# Altium schematic sheet BoardB-FPGA2.SchDoc
size A; SheetNumber: 4; SheetTotal: 9
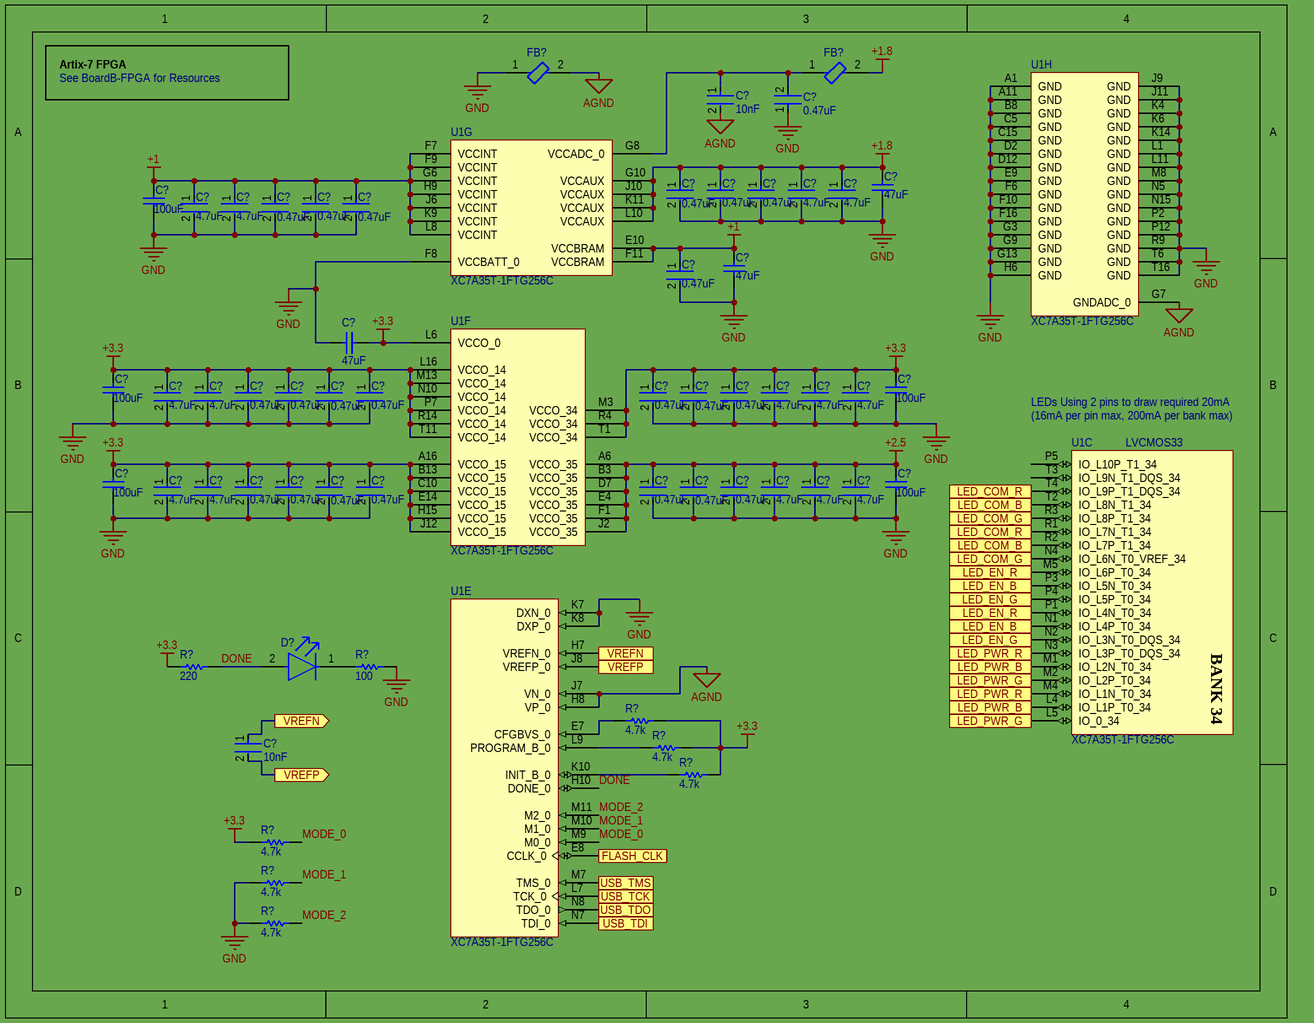
[diagram p0: BoardB-FPGA2.SchDoc]

## Parts
(Parts that share a designator on the sheet are numbered #1, #2 ... from top to bottom, then left to right.)
C?#1  10nF  [FP-GRM033-0_03-IPC_A]
C?#2  0.47uF  [FP-GRM033-0_03-IPC_C]
C?#3  0.47uF  [FP-GRM033-0_03-IPC_C]
C?#4  0.47uF  [FP-GRM033-0_03-IPC_C]
C?#5  0.47uF  [FP-GRM033-0_03-IPC_C]
C?#6  4.7uF  [FP-GRM155-0_1-IPC_B]
C?#7  4.7uF  [FP-GRM155-0_1-IPC_B]
C?#8  4.7uF  [FP-GRM155-0_1-IPC_B]
C?#9  4.7uF  [FP-GRM155-0_1-IPC_B]
C?#10  0.47uF  [FP-GRM033-0_03-IPC_C]
C?#11  0.47uF  [FP-GRM033-0_03-IPC_C]
C?#12  0.47uF  [FP-GRM033-0_03-IPC_C]
C?#13  47uF  [MURA-1210_H_2.7_L]
C?#14  100uF  [CAPC3216X190X55ML30T25]
C?#15  0.47uF  [FP-GRM033-0_03-IPC_C]
C?#16  47uF  [MURA-1210_H_2.7_L]
C?#17  47uF  [MURA-1210_H_2.7_L]
C?#18  4.7uF  [FP-GRM155-0_1-IPC_B]
C?#19  4.7uF  [FP-GRM155-0_1-IPC_B]
C?#20  0.47uF  [FP-GRM033-0_03-IPC_C]
C?#21  0.47uF  [FP-GRM033-0_03-IPC_C]
C?#22  0.47uF  [FP-GRM033-0_03-IPC_C]
C?#23  0.47uF  [FP-GRM033-0_03-IPC_C]
C?#24  0.47uF  [FP-GRM033-0_03-IPC_C]
C?#25  0.47uF  [FP-GRM033-0_03-IPC_C]
C?#26  0.47uF  [FP-GRM033-0_03-IPC_C]
C?#27  4.7uF  [FP-GRM155-0_1-IPC_B]
C?#28  4.7uF  [FP-GRM155-0_1-IPC_B]
C?#29  4.7uF  [FP-GRM155-0_1-IPC_B]
C?#30  100uF  [CAPC3216X190X55ML30T25]
C?#31  100uF  [CAPC3216X190X55ML30T25]
C?#32  4.7uF  [FP-GRM155-0_1-IPC_B]
C?#33  4.7uF  [FP-GRM155-0_1-IPC_B]
C?#34  0.47uF  [FP-GRM033-0_03-IPC_C]
C?#35  0.47uF  [FP-GRM033-0_03-IPC_C]
C?#36  0.47uF  [FP-GRM033-0_03-IPC_C]
C?#37  0.47uF  [FP-GRM033-0_03-IPC_C]
C?#38  0.47uF  [FP-GRM033-0_03-IPC_C]
C?#39  0.47uF  [FP-GRM033-0_03-IPC_C]
C?#40  0.47uF  [FP-GRM033-0_03-IPC_C]
C?#41  4.7uF  [FP-GRM155-0_1-IPC_B]
C?#42  4.7uF  [FP-GRM155-0_1-IPC_B]
C?#43  4.7uF  [FP-GRM155-0_1-IPC_B]
C?#44  100uF  [CAPC3216X190X55ML30T25]
C?#45  100uF  [CAPC3216X190X55ML30T25]
C?#46  10nF  [FP-CC0201-BA-MFG]
D?  SML-D12U1WT86  [FP-SML-D12-MFG]  (value not drawn)
FB?#1  BLM18AG601SN1D  [FP-BLM18-0_15-t0_8-MFG]  (value not drawn)
FB?#2  BLM18AG601SN1D  [FP-BLM18-0_15-t0_8-MFG]  (value not drawn)
R?#1  220  [RESC1005X40X25LL05T05]
R?#2  100  [RESC1005X40X25LL05T05]
R?#3  4.7k  [RESC1005X40X25LL05T05]
R?#4  4.7k  [RESC1005X40X25LL05T05]
R?#5  4.7k  [RESC1005X40X25LL05T05]
R?#6  4.7k  [RESC1005X40X25LL05T05]
R?#7  4.7k  [RESC1005X40X25LL05T05]
R?#8  4.7k  [RESC1005X40X25LL05T05]
U1  XC7A35T-1FTG256C  [FTG256]  (parts C,E,F,G,H of 8)

## Ports
FLASH_CLK (in), LED_COM_B (out), LED_COM_G (out), LED_COM_R (out), LED_EN_B (out), LED_EN_G (out), LED_EN_R (out), LED_PWR_B (out), LED_PWR_G (out), LED_PWR_R (out), USB_TCK, USB_TDI, USB_TDO, USB_TMS, VREFN (out), VREFP (out)

## Nets
+1: C?#8.1 C?#9.1 C?#10.1 C?#11.1 C?#12.1 C?#14.2 C?#15.1 C?#16.2 U1.E10(VCCBRAM) U1.F7(VCCINT) U1.F9(VCCINT) U1.F11(VCCBRAM) U1.G6(VCCINT) U1.H9(VCCINT) U1.J6(VCCINT) U1.K9(VCCINT) U1.L8(VCCINT)
+1.8: C?#3.1 C?#4.1 C?#5.1 C?#6.1 C?#7.1 C?#13.2 FB?#2.2 U1.G10(VCCAUX) U1.J10(VCCAUX) U1.K11(VCCAUX) U1.L10(VCCAUX)
+2.5: C?#38.1 C?#39.1 C?#40.1 C?#41.1 C?#42.1 C?#43.1 C?#45.2 U1.A6(VCCO_35) U1.B3(VCCO_35) U1.D7(VCCO_35) U1.E4(VCCO_35) U1.F1(VCCO_35) U1.J2(VCCO_35)
+3.3: C?#17.1 C?#18.1 C?#19.1 C?#20.1 C?#21.1 C?#22.1 C?#23.1 C?#24.1 C?#25.1 C?#26.1 C?#27.1 C?#28.1 C?#29.1 C?#30.2 C?#31.2 C?#32.1 C?#33.1 C?#34.1 C?#35.1 C?#36.1 C?#37.1 C?#44.2 R?#1.1 R?#3.1 R?#4.1 R?#5.2 R?#6.2 U1.A16(VCCO_15) U1.B13(VCCO_15) U1.C10(VCCO_15) U1.E14(VCCO_15) U1.H15(VCCO_15) U1.J12(VCCO_15) U1.L6(VCCO_0) U1.L16(VCCO_14) U1.M3(VCCO_34) U1.M13(VCCO_14) U1.N10(VCCO_14) U1.P7(VCCO_14) U1.R4(VCCO_34) U1.R14(VCCO_14) U1.T1(VCCO_34) U1.T11(VCCO_14)
AGND: C?#1.2 FB?#1.2 U1.G7(GNDADC_0) U1.H8(VP_0) U1.J7(VN_0)
GND: C?#2.1 C?#3.2 C?#4.2 C?#5.2 C?#6.2 C?#7.2 C?#8.2 C?#9.2 C?#10.2 C?#11.2 C?#12.2 C?#13.1 C?#14.1 C?#15.2 C?#16.1 C?#17.2 C?#18.2 C?#19.2 C?#20.2 C?#21.2 C?#22.2 C?#23.2 C?#24.2 C?#25.2 C?#26.2 C?#27.2 C?#28.2 C?#29.2 C?#30.1 C?#31.1 C?#32.2 C?#33.2 C?#34.2 C?#35.2 C?#36.2 C?#37.2 C?#38.2 C?#39.2 C?#40.2 C?#41.2 C?#42.2 C?#43.2 C?#44.1 C?#45.1 FB?#1.1 R?#2.2 R?#7.2 R?#8.2 U1.A1(GND) U1.A11(GND) U1.B8(GND) U1.C5(GND) U1.C15(GND) U1.D2(GND) U1.D12(GND) U1.E9(GND) U1.F6(GND) U1.F8(VCCBATT_0) U1.F10(GND) U1.F16(GND) U1.G3(GND) U1.G9(GND) U1.G13(GND) U1.H6(GND) U1.J9(GND) U1.J11(GND) U1.K4(GND) U1.K6(GND) U1.K7(DXN_0) U1.K8(DXP_0) U1.K14(GND) U1.L1(GND) U1.L11(GND) U1.M8(GND) U1.N5(GND) U1.N15(GND) U1.P2(GND) U1.P12(GND) U1.R9(GND) U1.T6(GND) U1.T16(GND)
DONE: D?.2(A) R?#1.2 U1.H10(DONE_0)
FLASH_CLK: U1.E8(CCLK_0) ; port FLASH_CLK
LED_COM_B: U1.R2(IO_L7P_T1_34) U1.T2(IO_L8N_T1_34) ; port LED_COM_B
LED_COM_G: U1.N4(IO_L6N_T0_VREF_34) U1.R3(IO_L8P_T1_34) ; port LED_COM_G
LED_COM_R: U1.R1(IO_L7N_T1_34) U1.T4(IO_L9P_T1_DQS_34) ; port LED_COM_R
LED_EN_B: U1.N1(IO_L4P_T0_34) U1.P3(IO_L5N_T0_34) ; port LED_EN_B
LED_EN_G: U1.N2(IO_L3N_T0_DQS_34) U1.P4(IO_L5P_T0_34) ; port LED_EN_G
LED_EN_R: U1.M5(IO_L6P_T0_34) U1.P1(IO_L4N_T0_34) ; port LED_EN_R
LED_PWR_B: U1.L4(IO_L1P_T0_34) U1.M1(IO_L2N_T0_34) ; port LED_PWR_B
LED_PWR_G: U1.L5(IO_0_34) U1.M2(IO_L2P_T0_34) ; port LED_PWR_G
LED_PWR_R: U1.M4(IO_L1N_T0_34) U1.N3(IO_L3P_T0_DQS_34) ; port LED_PWR_R
MODE_0: R?#6.1 U1.M9(M0_0)
MODE_1: R?#7.1 U1.M10(M1_0)
MODE_2: R?#8.1 U1.M11(M2_0)
USB_TCK: U1.L7(TCK_0) ; port USB_TCK
USB_TDI: U1.N7(TDI_0) ; port USB_TDI
USB_TDO: U1.N8(TDO_0) ; port USB_TDO
USB_TMS: U1.M7(TMS_0) ; port USB_TMS
VREFN: C?#46.1 U1.H7(VREFN_0) ; port VREFN
VREFP: C?#46.2 U1.J8(VREFP_0) ; port VREFP
NetC?#1_1: C?#1.1 C?#2.2 FB?#2.1 U1.G8(VCCADC_0)
NetD?_1: D?.1(C) R?#2.1
NetR?#3_2: R?#3.2 U1.E7(CFGBVS_0)
NetR?#4_2: R?#4.2 U1.L9(PROGRAM_B_0)
NetR?#5_1: R?#5.1 U1.K10(INIT_B_0)

Not connected (* = marked no-connect by the designer): U1 P5(IO_L10P_T1_34) T3(IO_L9N_T1_DQS_34)

## Notes on the sheet
- Artix-7 FPGA
- See BoardB-FPGA for Resources
- LEDs Using 2 pins to draw required 20mA
- (near U1) (16mA per pin max, 200mA per bank max)
- LVCMOS33
- (in symbol CMP-0383-00028-1, part C) BANK 34

## Library data of the parts
C?#1 = CMP-2010-01684-2: Chip Multilayer Ceramic Capacitors for General Purpose, 0201, 10000pF, X7R, 15%, 10%, 10V; Package Quantity: 1; Width: 0.012inch; Voltage: 10V; Mount: Surface Mount; Capacitance: 10nF; Voltage Rating (DC): 10V; Voltage Rating: 10V; Length: 0.6mm; Packaging: Tape and Reel; Material: Ceramic; Dielectric: X7R; REACH SVHC: No SVHC; Termination: SMD/SMT; Case/Package: 0201; Radiation Hardening: No; Height: 0.3mm; Tolerance: 10%; Case Code (Imperial): 0201; Min Operating Temperature: -55°C; Lead Free: Lead Free; Thickness: 0.013inch; Depth: 0.3mm; Case Code (Metric): 0603; Max Operating Temperature: 125°C
C?#2-C?#5 C?#10-C?#12 C?#15 C?#20-C?#26 C?#34-C?#40 = CMP-06035-010465-1: Chip Multilayer Ceramic Capacitors for General Purpose, 0201, 0.47uF, X5R, 15%, 10%, 6.3V; Capacitance: 470nF; Thickness: 0.013inch; Depth: 0.3mm; Height: 0.3mm; Mount: Surface Mount; Max Operating Temperature: 85°C; Tolerance: 10%; Dielectric: X5R; Length: 0.6mm; Package Quantity: 15000; Weight: 1.2E-05oz; Voltage Rating (DC): 6.3V; Lead Free: Lead Free; Termination: SMD/SMT; Voltage Rating: 6.3V; Case Code (Imperial): 0201; Width: 0.012inch; Case/Package: 0201; Case Code (Metric): 0603; Min Operating Temperature: -55°C; Packaging: Tape and Reel
C?#6-C?#9 C?#18 C?#19 C?#27-C?#29 C?#32 C?#33 C?#41-C?#43 = CMP-2008-04549-2: Chip Multilayer Ceramic Capacitors for General Purpose, 0402, 4.7uF, X5R, 15%, 20%, 6.3V; Height: 0.5mm; Weight: 0.000212oz; Length: 1mm; Case Code (Metric): 1005; Packaging: Tape and Reel; Termination: SMD/SMT; Dielectric: X5R; Depth: 0.5mm; Case Code (Imperial): 0402; Min Operating Temperature: -55°C; Case/Package: 0402; Voltage: 6.3V; Width: 0.02inch; Capacitance: 4.7uF; Lead Free: Lead Free; Thickness: 0.022inch; Contact Plating: Tin; REACH SVHC: No SVHC; Package Quantity: 10000; Tolerance: 20%; Voltage Rating (DC): 6.3V; Voltage Rating: 6.3V; Mount: Surface Mount; Max Operating Temperature: 85°C
C?#13 C?#16 C?#17 = CMP-2000-06362-1: Cap Ceramic, 47 uF, +/- 10%, -55 to 85 degC, 2-Pin SMD (1210), RoHS, Tape and Reel; Manufacturer: Murata; Catalog Drawings: GRMSeries_1210_2.5; Voltage Rating DC: 16V; Capacitance: 47µF; Product Training Modules: High-CapMultilayerCeramicCapacitors; Temperature Coefficient: X5R; Online Catalog: GRMSeries; Other Names: 490-6539-6; Lead Style: -; Datasheet URL: http://psearch.en.murata.com/capacitor/product/GRM32ER61C476KE15%23.pdf; Package Description: 2-Pin Surface Mount Device, Body 3.2 x 2.5 mm; Applications: GeneralPurpose; Thickness (Max): 0.106"(2.70mm); Operating Temperature: -55°C~85°C; Mounting Technology: SurfaceMount; Category: Capacitors; Package / Case: 1210(3225Metric); Mounting Type: SurfaceMount,MLCC; Ratings: -; Package Reference: 1210; Height - Seated (Max): -; Series: GRM; Lead Spacing: -; Family: CeramicCapacitors; Datasheet Version: 04/2016; Tolerance: ±10%; Size / Dimension: 0.126"Lx0.098"W(3.20mmx2.50mm); Packaging: Digi-Reel®; Voltage - Rated: 16V; Standard Package: 1; Features: -; Manufacturer URL: http://www.murata.com/
C?#14 C?#30 C?#31 C?#44 C?#45 = CMP-1662-00011-2: Chip Capacitor, 100 uF, +/- 20%, 6.3 V, -55 to 85 degC, 1206 (3216 Metric), RoHS, Tape and Reel; PartNumber: GRM31CR60J107ME39L; Case\/Package: 1206; Voltage Rating (DC): 6.3 V; Type (Capacitors): X5R; REACH SVHC: No SVHC; Height: 1.6 mm; Tolerance: 20%; Packaging: Tape and Reel; Mount: Surface Mount; PackageDescription: 2-Pin Surface Mount Device, Body 3.2 x 1.6 mm; ComponentLink1URL: http://www.murata.com/; Pins: 2; ComponentLink2Description: Datasheet; PackageReference: 1206; Width: 1.6 mm; Package Quantity: 2000; Capacitance: 100 uF; Min Operating Temperature: -55 degC; Case Code (Imperial): 1206; Max Operating Temperature: 85 degC; DatasheetVersion: 09/2016; Mounting Technology: Surface Mount; Voltage Rating: 6.3 V; ComponentLink1Description: Manufacturer URL; Radiation Hardening: No; Case Code (Metric): 3216; Length: 3.2 mm; ComponentLink2URL: http://psearch.en.murata.com/capacitor/product/GRM31CR60J107ME39%23.pdf; RoHSCompliant: true
C?#46 = CMP-03422-000237-1: CAP CER 10000PF 16V X7R 0201; Manufacturer: Yageo; Manufacturer Part Number: CC0201KRX7R7BB103; Material: Ceramic; Tolerance: 0.1; Temperature Coefficient: 15%; Ipc Land Pattern Name: CAPC6030X30; Value: 10 nF; Footprint Url: http://www.yageo.com/exep/pages/download/literatures/UPY-C_GEN_24.pdf; Device Class L2: Capacitors; Mouser Description: Multilayer Ceramic Capacitors MLCC - SMD/SMT 10nF 16V X7R 10%; Octopart: https://octopart.com/cc0201krx7r7bb103-yageo-9292627; Temperature: -55°C to +85°C; Package: CC0201-BA; Capacitance: 10 nF; Device Class L1: Passive Components; Device Class L3: Ceramic Capacitors; Digikey Description: CAP CER 10000PF 16V X7R 0201; ComponentLink2URL: http://www.yageo.com/documents/recent/UPY-GPHC_X5R_4V-to-50V_25.pdf; Temperature Characteristic: X7R; Automotive: No; RoHS: TRUE; Voltage Rating: 16 V; Temperature Range Low: -55°C; Category: Cap; Height: 0.33mm; ComponentLink2Description: Datasheet; Temperature Range High: +85°C; Lead Free: Yes
D? = CMP-08952-000009-1: LED RED DIFFUSED 1608 SMD; Manufacturer: Rohm; Led Orientation: Top View; Power Dissipation: 54mW; Forward Current: 20mA; Wavelength: 620nm; Reverse Voltage: 5V; Luminous Intensity: 63mcd; Forward Voltage: 2.2V; Mouser Description: SML-D12 Series Red 0603 Diffused 63 mcd 2.2 V Surface Mount LED; Temperature: -40°C to +85°C; Device Class L2: LEDs; Lead Free: Yes; Automotive: No; Octopart: https://octopart.com/sml-d12u1wt86-rohm-70850259; RoHS: TRUE; Colour: Red; Digikey Description: LED RED DIFFUSED 1608 SMD; Package: SML-D12; Device Class L1: Optoelectronics; Category: Diode; Temperature Range High: +85°C; Height: 0.65mm; ComponentLink2Description: Datasheet; Temperature Range Low: -40°C; ComponentLink2URL: https://www.rohm.com/datasheet/SML-D12U1W/sml-d12x1-e; Manufacturer Part Number: SML-D12U1WT86; Device Class L3: unset
FB?#1 FB?#2 = CMP-0686-00436-3: Chip Ferrite Bead, 0603, 600Ω @ 100MHz, 0.38Ω, 25%, 500mA; Number of Lines: 1; Impedance: 600R; DC Resistance (DCR): 380mR; Material: Steel; Shielding: Unshielded; Max DC Current: 500mA; Termination: SMD/SMT; Military Standard: Not; Number of Circuits: 1; Min Operating Temperature: -55°C; Case Code (Imperial): 0603; Width: 0.8mm; Current Rating: 500mA; Lead Free: Lead Free; Packaging: Tape and Reel; Frequency: 100MHz; Max Operating Temperature: 125°C; DC Current: 500mA; REACH SVHC: No SVHC; Case/Package: 0603; Package Quantity: 1; Height: 0.8mm; Number of Pins: 2; Depth: 0.8mm; Test Frequency: 100MHz; Case Code (Metric): 1608; Tolerance: 25%; Core Material: Ferrite; Weight: 7.1E-05oz; Max Current Rating: 500mA; Radiation Hardening: No; Length: 1.6mm; RoHS Compliant: Yes
R?#1 = CMP-2002-00487-3: Chip Resistor, 220 Ohm, +/- 5%, 100 mW, -55 to 155 degC, 0402 (1005 Metric), RoHS, Tape and Reel; Manufacturer: Basic Passives; PartNumber: ERJ-2GEJ221X; Voltage Rating: 50 V; Case\/Package: 0402; Power Rating: 100 mW; Resistance: 220 Ohm; Mounting Technology: Surface Mount; Width: 0.5 mm; Package Quantity: 10000; REACH SVHC: Unknown; Height: 0.35 mm; PackageReference: 0402; PackageDescription: 2-Pin Surface Mount Device, Body 1 x 0.5 mm; Length: 1 mm; Max Operating Temperature: 155 degC; Tolerance: 5%; ComponentLink1Description: Manufacturer URL; Pins: 2; ComponentLink1URL: http://www.panasonic.com/; Min Operating Temperature: -55 degC; Case Code (Imperial): 0402; Mount: Surface Mount; Case Code (Metric): 1005; ComponentLink2URL: http://industrial.panasonic.com/cdbs/www-data/pdf/RDA0000/AOA0000C84.pdf; Packaging: Tape and Reel; ComponentLink2Description: Datasheet; DatasheetVersion: 04/2015; Radiation Hardening: No; RoHSCompliant: true
R?#2 = CMP-2002-00605-3: Chip Resistor, 100 Ohm, +/- 1%, 100 mW, -55 to 155 degC, 0402 (1005 Metric), RoHS, Tape and Reel; Manufacturer: Basic Passives; PartNumber: ERJ-2RKF1000X; Power Rating: 100 mW; Resistance: 100 Ohm; Voltage Rating: 50 V; Case\/Package: 0402; Width: 0.5 mm; Pins: 2; ComponentLink2Description: Datasheet; PackageReference: 0402; Height: 0.35 mm; Tolerance: 1%; DatasheetVersion: 04/2015; Case Code (Imperial): 0402; Min Operating Temperature: -55 degC; Radiation Hardening: No; Length: 1 mm; Package Quantity: 10000; PackageDescription: 2-Pin Surface Mount Device, Body 1 x 0.5 mm; Mounting Technology: Surface Mount; Case Code (Metric): 1005; Packaging: Tape and Reel; ComponentLink1URL: http://www.panasonic.com/; RoHSCompliant: true; Max Operating Temperature: 155 degC; REACH SVHC: Yes; ComponentLink1Description: Manufacturer URL; ComponentLink2URL: http://industrial.panasonic.com/cdbs/www-data/pdf/RDA0000/AOA0000C86.pdf; Mount: Surface Mount
R?#3-R?#8 = CMP-2002-01154-4: Chip Resistor, 4.7 KOhm, +/- 1%, 0.1 W, -55 to 155 degC, 0402 (1005 Metric), RoHS, Tape and Reel; PartNumber: ERJ-2RKF4701X; Voltage Rating: 50 V; Case\/Package: 0402; Power Rating: 100 mW; Height: 0.35 mm; Mounting Technology: Surface Mount; REACH SVHC: Yes; Resistance: 4.7 KOhm; Max Operating Temperature: 155 degC; ComponentLink1Description: Manufacturer URL; ComponentLink2Description: Datasheet; Pins: 2; PackageReference: 0402; Tolerance: 1%; Case Code (Imperial): 0402; Length: 1 mm; PackageDescription: 2-Pin Surface Mount Device, Body 1 x 0.5 mm; RoHSCompliant: true; Package Quantity: 1; Radiation Hardening: No; DatasheetVersion: 04/2015; Width: 0.5 mm; Case Code (Metric): 1005; Mount: Surface Mount; ComponentLink1URL: http://www.panasonic.com/; Min Operating Temperature: -55 degC; Packaging: Cut Tape; ComponentLink2URL: http://industrial.panasonic.com/cdbs/www-data/pdf/RDA0000/AOA0000C86.pdf
U1 = CMP-0383-00028-1: Artix-7 FPGA, 170 User I/Os, 0 GTP, 256-Ball BGA, Speed Grade 1, Commercial Grade, Pb-Free; Manufacturer: Xilinx; Speed Grades: 1; Total Block RAM: 1800 Kb; CMTs: 5; GTP: 0; Available User I/O: 170; Logic Cells: 33280; ComponentLink2Description: Datasheet; ComponentLink2URL: http://www.xilinx.com/support/documentation/data_sheets/ds180_7Series_Overview.pdf; ComponentLink1Description: Manufacturer URL; Operating Temperature Range: Commercial; PackageVersion: Rev. 1.11; ComponentLink4URL: http://www.xilinx.com/support/documentation/user_guides/ug475_7Series_Pkg_Pinout.pdf; ComponentLink4Description: Package Specification; PackageDescription: 256-Ball Wire-Bond Fine-Pitch Thin BGA, Body 17 x 17 mm, Pitch 1 mm; Mounting Technology: Surface Mount; ComponentLink1URL: http://www.xilinx.com/; Maximum Distributed RAM: 400 Kb; PackageReference: FTG-256; DatasheetVersion: Rev. 1.15; ComponentLink3Description: Pinout; PartNumber: XC7A35T-1FTG256C; ComponentLink3URL: http://www.xilinx.com/support/documentation/user_guides/ug475_7Series_Pkg_Pinout.pdf